# EAGLE design RPi_Shield (EAGLE 9.6.2)
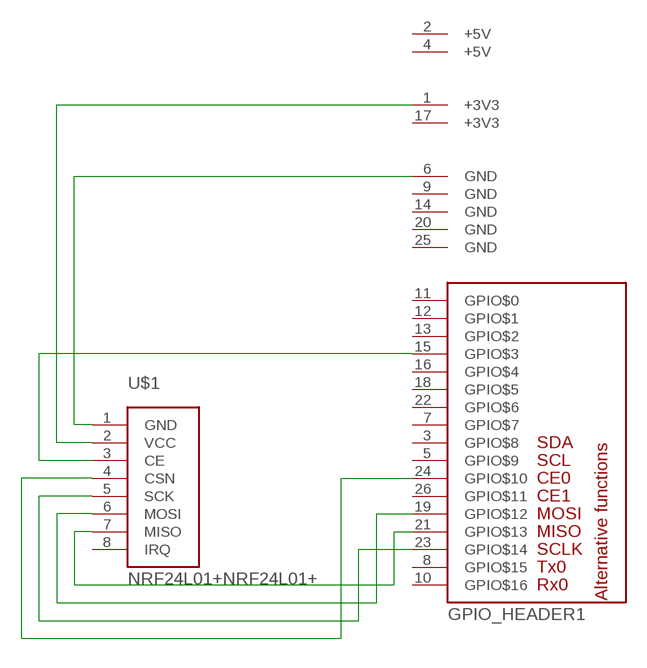
[diagram p0: schematic, sheet 1]

## Parts
GPIO_HEADER1  RPI_GPIO_HEADER  [2X13]
U$1  NRF24L01+NRF24L01+  [NRF24L01+]

## Nets
GND: GPIO_HEADER1.6(GND) U$1.1(GND)
N$2: GPIO_HEADER1.1(+3V3) U$1.2(VCC)
N$3: GPIO_HEADER1.21(GPIO$13) U$1.7(MISO)
N$4: GPIO_HEADER1.19(GPIO$12) U$1.6(MOSI)
N$5: GPIO_HEADER1.23(GPIO$14) U$1.5(SCK)
N$6: GPIO_HEADER1.15(GPIO$3) U$1.3(CE)
N$7: GPIO_HEADER1.24(GPIO$10) U$1.4(CSN)
Unconnected: GPIO_HEADER1.3(GPIO$8) GPIO_HEADER1.5(GPIO$9) GPIO_HEADER1.7(GPIO$7) GPIO_HEADER1.8(GPIO$15) GPIO_HEADER1.10(GPIO$16) GPIO_HEADER1.11(GPIO$0) GPIO_HEADER1.12(GPIO$1) GPIO_HEADER1.13(GPIO$2) GPIO_HEADER1.16(GPIO$4) GPIO_HEADER1.18(GPIO$5) GPIO_HEADER1.22(GPIO$6) GPIO_HEADER1.26(GPIO$11) U$1.8(IRQ)

## Power pins joined to a net without a drawn wire
+3V3: GPIO_HEADER1.17(+3V3)
+5V: GPIO_HEADER1.2(+5V) GPIO_HEADER1.4(+5V)
GND: GPIO_HEADER1.9(GND) GPIO_HEADER1.14(GND) GPIO_HEADER1.20(GND) GPIO_HEADER1.25(GND)

## Library data of the parts
GPIO_HEADER1 = rpi-header:RPI_GPIO_HEADER: Raspberry PI GPIO Header (raspberry pi rev 2). Numbering is taken from WiringPi http://wiringpi.com/pins/ .
U$1 = nRF24l01+:NRF24L01+

## Board
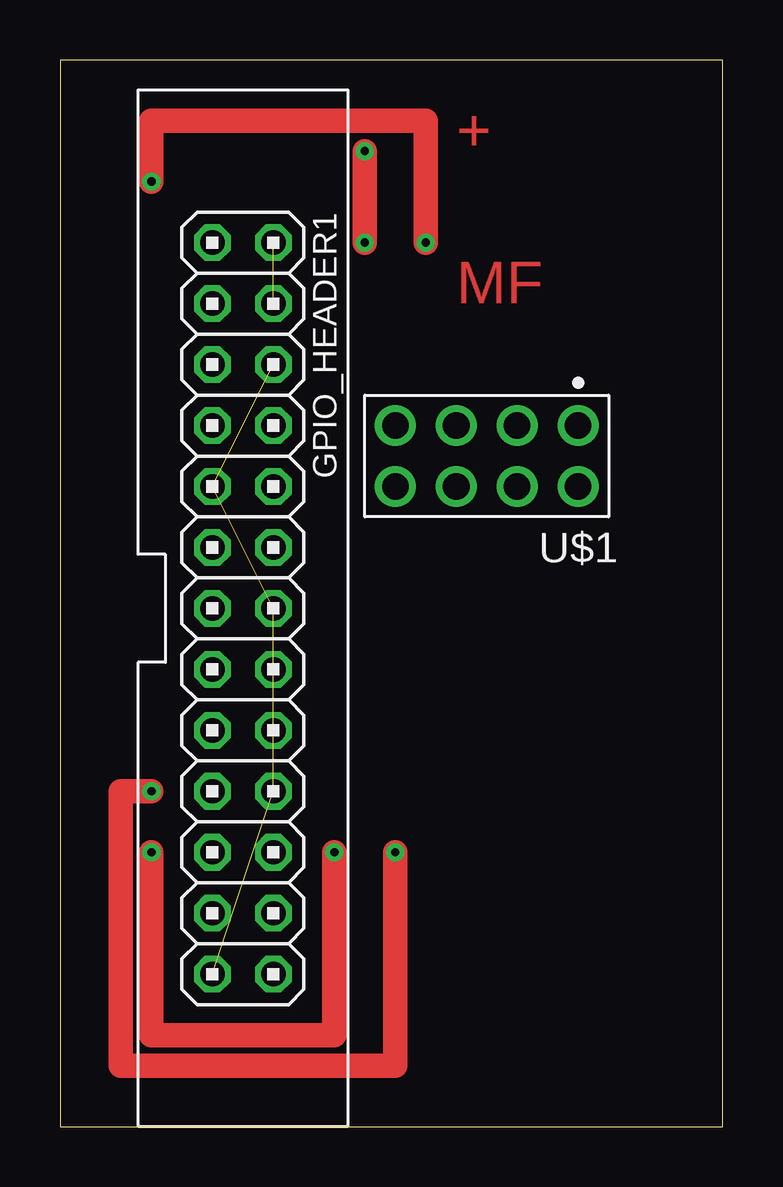
[diagram p1: board, top side]
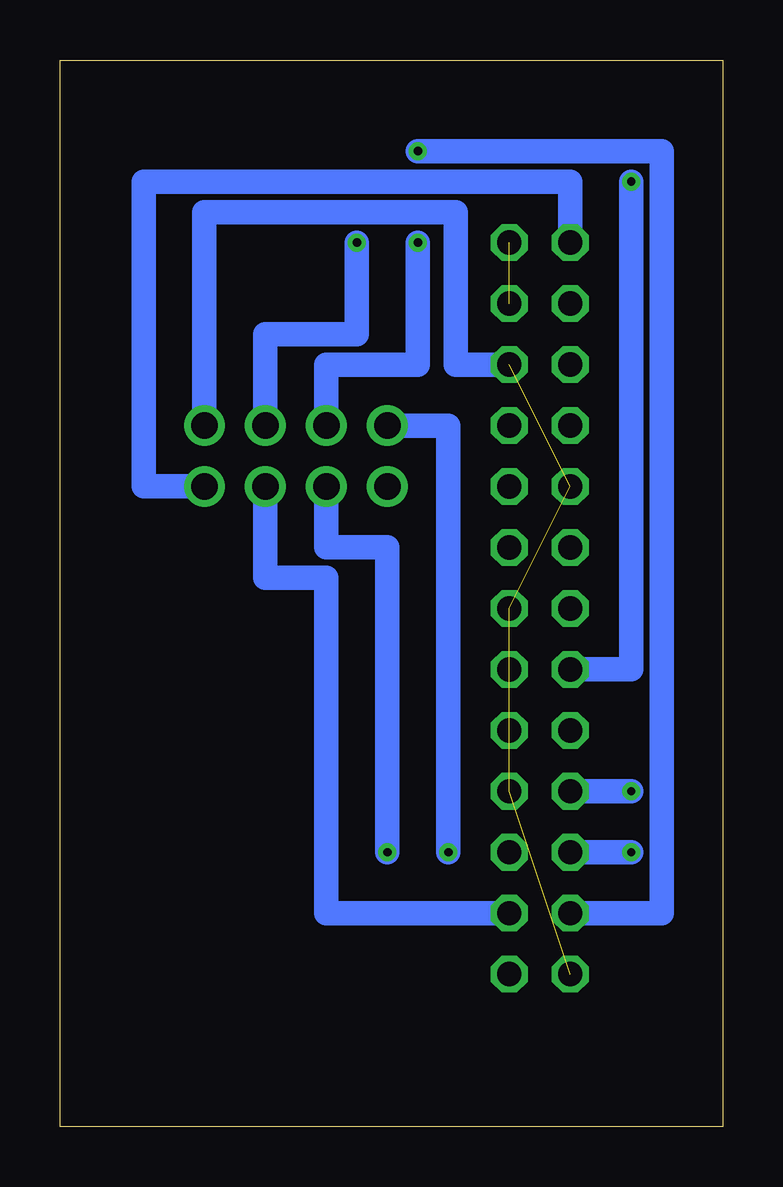
[diagram p2: board, bottom side, seen from below]

Size 27.61 x 44.44 mm. Coordinates in mm from the lower left corner, seen from the top.
Outline: 0,0 27.61,0 27.61,44.44 0,44.44 0,0
Copper layers (1*16): Top 0.035mm / dielectric 1.5mm / Bottom 0.035mm
Design rules "default": minimum track width 6mil, minimum drill 0.35mm, track to track 6mil, track to pad 6mil, pad to pad 6mil, via to via 6mil, smd to smd 6mil, copper to edge 40mil, drill to drill 6mil, minimum pad ring 10mil, minimum via ring 8mil, stop-mask expansion 4mil, vias tented up to drill 0mil, thermal gap 10mil

### Footprints (pad centres in the part's own frame; a part is rotated, then mirrored left to right if it is on the bottom)
2X13 = drill 1.016 octagon: 1 -15.24,-1.27; 2 -15.24,1.27; 3 -12.7,-1.27; 4 -12.7,1.27; 5 -10.16,-1.27; 6 -10.16,1.27; 7 -7.62,-1.27; 8 -7.62,1.27; 9 -5.08,-1.27; 10 -5.08,1.27; 11 -2.54,-1.27; 12 -2.54,1.27; 13 0,-1.27; 14 0,1.27; 15 2.54,-1.27; 16 2.54,1.27; 17 5.08,-1.27; 18 5.08,1.27; 19 7.62,-1.27; 20 7.62,1.27; 21 10.16,-1.27; 22 10.16,1.27; 23 12.7,-1.27; 24 12.7,1.27; 25 15.24,-1.27; 26 15.24,1.27
NRF24L01+ = drill 1.105 pad 1.705: 1 0,0; 2 0,2.54; 3 2.54,0; 4 2.54,2.54; 5 5.08,0; 6 5.08,2.54; 7 7.62,0; 8 7.62,2.54

### Placement (x,y rotation side)
GPIO_HEADER1  7.62,21.59 270 top
U$1  21.59,29.21 180 top

### Tracks (layer width: path | path; a pad name or v marks a point on that pad's centre or on a via)
+5V  (1 unrouted)
GND  (4 unrouted)
  Bottom 1.016: U$1.1 21.59,38.1 11.11,38.1 11.11,31.75 GPIO_HEADER1.6
N$2
  Bottom 1.016: GPIO_HEADER1.1 6.35,39.37 24.13,39.37 24.13,26.67 U$1.2
N$3  (via drill 0.35)
  Top 1.016: v11.43,11.43 11.43,3.81 3.81,3.81 v3.81,11.43
  Bottom 1.016: U$1.7 11.43,29.21 v11.43,11.43 | v3.81,11.43 GPIO_HEADER1.21
N$4  (via drill 0.35)
  Top 1.016: v13.97,11.43 13.97,2.54 2.54,2.54 2.54,13.97 v3.81,13.97
  Bottom 1.016: v3.81,13.97 GPIO_HEADER1.19 | v13.97,11.43 13.97,24.13 16.51,24.13 U$1.6
N$5  (via drill 0.35)
  Top 1.016: v12.7,40.64 v12.7,36.83
  Bottom 1.016: GPIO_HEADER1.23 2.54,8.89 2.54,40.64 v12.7,40.64 | v12.7,36.83 12.7,31.75 16.51,31.75 U$1.5
N$6  (via drill 0.35)
  Top 1.016: v3.81,39.37 3.81,41.91 15.24,41.91 v15.24,36.83
  Bottom 1.016: GPIO_HEADER1.15 3.81,19.05 v3.81,39.37 | v15.24,36.83 15.24,33.02 19.05,33.02 U$1.3
N$7
  Bottom 1.016: GPIO_HEADER1.24 16.51,8.89 16.51,22.86 19.05,22.86 U$1.4

### Text on the board
Top: + | MF